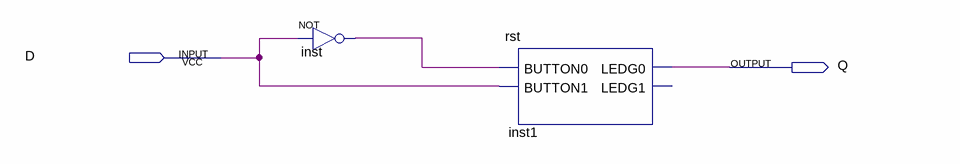
[diagram p0: schematic sheet]
// Quartus schematic Lab7_2.bdf as structural Verilog: 2 symbols, 2 pins
module Lab7_2 (
  input  D,
  output Q
);

  wire inst_out;

  not inst (inst_out, D);
  rst inst1 (.BUTTON0(inst_out), .BUTTON1(D), .LEDG0(Q));  // open: LEDG1
endmodule
